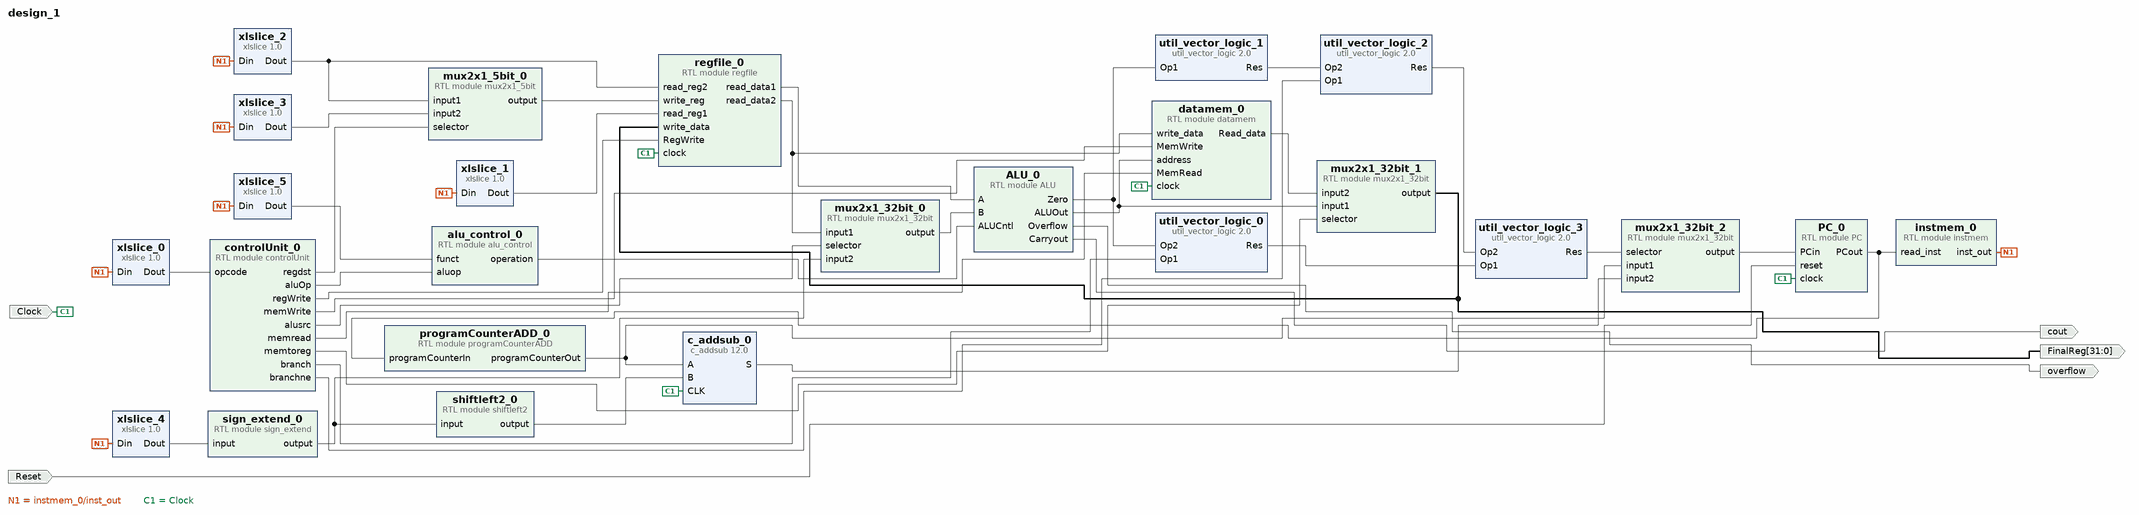
[diagram p0: block diagram of the top level]
# Vivado block design design_1, xc7k70tfbv676-1, Vivado 2019.2.1
create_bd_design design_1

create_bd_port -dir I -type clk Clock
set_property -dict {CONFIG.FREQ_HZ 100000000} [get_bd_ports Clock]
create_bd_port -dir I -type rst Reset
set_property -dict {CONFIG.POLARITY ACTIVE_HIGH} [get_bd_ports Reset]
create_bd_port -dir O -from 31 -to 0 -type data FinalReg
create_bd_port -dir O -type data overflow
create_bd_port -dir O -type data cout

create_bd_cell -type module -reference ALU ALU_0
create_bd_cell -type module -reference PC PC_0
create_bd_cell -type module -reference datamem datamem_0
create_bd_cell -type module -reference instmem instmem_0
create_bd_cell -type module -reference mux2x1_5bit mux2x1_5bit_0
create_bd_cell -type module -reference programCounterADD programCounterADD_0
create_bd_cell -type module -reference regfile regfile_0
create_bd_cell -type module -reference shiftleft2 shiftleft2_0
create_bd_cell -type module -reference sign_extend sign_extend_0
create_bd_cell -type module -reference controlUnit controlUnit_0
create_bd_cell -type ip -vlnv xilinx.com:ip:xlslice:1.0 xlslice_0
set_property -dict {CONFIG.DIN_FROM 31 CONFIG.DIN_TO 26 CONFIG.DIN_WIDTH 32 CONFIG.DOUT_WIDTH 6} [get_bd_cells xlslice_0]
create_bd_cell -type ip -vlnv xilinx.com:ip:xlslice:1.0 xlslice_1
set_property -dict {CONFIG.DIN_FROM 25 CONFIG.DIN_TO 21 CONFIG.DIN_WIDTH 32 CONFIG.DOUT_WIDTH 5} [get_bd_cells xlslice_1]
create_bd_cell -type ip -vlnv xilinx.com:ip:xlslice:1.0 xlslice_2
set_property -dict {CONFIG.DIN_FROM 20 CONFIG.DIN_TO 16 CONFIG.DIN_WIDTH 32 CONFIG.DOUT_WIDTH 5} [get_bd_cells xlslice_2]
create_bd_cell -type ip -vlnv xilinx.com:ip:xlslice:1.0 xlslice_3
set_property -dict {CONFIG.DIN_FROM 15 CONFIG.DIN_TO 11 CONFIG.DIN_WIDTH 32 CONFIG.DOUT_WIDTH 5} [get_bd_cells xlslice_3]
create_bd_cell -type ip -vlnv xilinx.com:ip:xlslice:1.0 xlslice_4
set_property -dict {CONFIG.DIN_FROM 15 CONFIG.DIN_TO 0 CONFIG.DIN_WIDTH 32 CONFIG.DOUT_WIDTH 16} [get_bd_cells xlslice_4]
create_bd_cell -type ip -vlnv xilinx.com:ip:xlslice:1.0 xlslice_5
set_property -dict {CONFIG.DIN_FROM 5 CONFIG.DIN_TO 0 CONFIG.DIN_WIDTH 32 CONFIG.DOUT_WIDTH 6} [get_bd_cells xlslice_5]
create_bd_cell -type ip -vlnv xilinx.com:ip:c_addsub:12.0 c_addsub_0
set_property -dict [list \
  CONFIG.A_Width 32 \
  CONFIG.B_Value 00000000000000000000000000000000 \
  CONFIG.B_Width 32 \
  CONFIG.CE false \
  CONFIG.Latency 1 \
  CONFIG.Out_Width 32 \
] [get_bd_cells c_addsub_0]
create_bd_cell -type ip -vlnv xilinx.com:ip:util_vector_logic:2.0 util_vector_logic_0
set_property -dict {CONFIG.C_SIZE 1} [get_bd_cells util_vector_logic_0]
create_bd_cell -type ip -vlnv xilinx.com:ip:util_vector_logic:2.0 util_vector_logic_1
set_property -dict {CONFIG.C_OPERATION not CONFIG.C_SIZE 1} [get_bd_cells util_vector_logic_1]
create_bd_cell -type ip -vlnv xilinx.com:ip:util_vector_logic:2.0 util_vector_logic_2
set_property -dict {CONFIG.C_SIZE 1} [get_bd_cells util_vector_logic_2]
create_bd_cell -type ip -vlnv xilinx.com:ip:util_vector_logic:2.0 util_vector_logic_3
set_property -dict {CONFIG.C_OPERATION or CONFIG.C_SIZE 1} [get_bd_cells util_vector_logic_3]
create_bd_cell -type module -reference mux2x1_32bit mux2x1_32bit_0
create_bd_cell -type module -reference mux2x1_32bit mux2x1_32bit_1
create_bd_cell -type module -reference mux2x1_32bit mux2x1_32bit_2
create_bd_cell -type module -reference alu_control alu_control_0

# ---- connections ----

connect_bd_net [get_bd_pins PC_0/PCout] [get_bd_pins instmem_0/read_inst] [get_bd_pins programCounterADD_0/programCounterIn]
connect_bd_net [get_bd_pins instmem_0/inst_out] \
  [get_bd_pins xlslice_0/Din] [get_bd_pins xlslice_1/Din] [get_bd_pins xlslice_2/Din] [get_bd_pins xlslice_3/Din] \
  [get_bd_pins xlslice_4/Din] [get_bd_pins xlslice_5/Din]
connect_bd_net [get_bd_pins xlslice_0/Dout] [get_bd_pins controlUnit_0/opcode]
connect_bd_net [get_bd_pins xlslice_1/Dout] [get_bd_pins regfile_0/read_reg1]
connect_bd_net [get_bd_pins xlslice_2/Dout] [get_bd_pins regfile_0/read_reg2] [get_bd_pins mux2x1_5bit_0/input1]
connect_bd_net [get_bd_pins controlUnit_0/regdst] [get_bd_pins mux2x1_5bit_0/selector]
connect_bd_net [get_bd_pins xlslice_3/Dout] [get_bd_pins mux2x1_5bit_0/input2]
connect_bd_net [get_bd_pins mux2x1_5bit_0/output] [get_bd_pins regfile_0/write_reg]
connect_bd_net [get_bd_pins xlslice_4/Dout] [get_bd_pins sign_extend_0/input]
connect_bd_net [get_bd_pins xlslice_5/Dout] [get_bd_pins alu_control_0/funct]
connect_bd_net [get_bd_pins sign_extend_0/output] [get_bd_pins shiftleft2_0/input] [get_bd_pins mux2x1_32bit_0/input2]
connect_bd_net [get_bd_pins controlUnit_0/regWrite] [get_bd_pins regfile_0/RegWrite]
connect_bd_net [get_bd_pins regfile_0/read_data1] [get_bd_pins ALU_0/A]
connect_bd_net [get_bd_pins mux2x1_32bit_0/output] [get_bd_pins ALU_0/B]
connect_bd_net [get_bd_pins regfile_0/read_data2] [get_bd_pins datamem_0/write_data] [get_bd_pins mux2x1_32bit_0/input1]
connect_bd_net [get_bd_pins controlUnit_0/alusrc] [get_bd_pins mux2x1_32bit_0/selector]
connect_bd_net [get_bd_pins controlUnit_0/aluOp] [get_bd_pins alu_control_0/aluop]
connect_bd_net [get_bd_pins alu_control_0/operation] [get_bd_pins ALU_0/ALUCntl]
connect_bd_net [get_bd_pins controlUnit_0/memWrite] [get_bd_pins datamem_0/MemWrite]
connect_bd_net [get_bd_pins controlUnit_0/memread] [get_bd_pins datamem_0/MemRead]
connect_bd_net [get_bd_pins controlUnit_0/memtoreg] [get_bd_pins mux2x1_32bit_1/selector]
connect_bd_net [get_bd_pins datamem_0/Read_data] [get_bd_pins mux2x1_32bit_1/input2]
connect_bd_net [get_bd_pins ALU_0/ALUOut] [get_bd_pins datamem_0/address] [get_bd_pins mux2x1_32bit_1/input1]
connect_bd_net [get_bd_pins mux2x1_32bit_1/output] [get_bd_pins regfile_0/write_data] [get_bd_ports FinalReg]
connect_bd_net [get_bd_pins shiftleft2_0/output] [get_bd_pins c_addsub_0/B]
connect_bd_net [get_bd_pins programCounterADD_0/programCounterOut] [get_bd_pins c_addsub_0/A] [get_bd_pins mux2x1_32bit_2/input1]
connect_bd_net [get_bd_pins c_addsub_0/S] [get_bd_pins mux2x1_32bit_2/input2]
connect_bd_net [get_bd_pins controlUnit_0/branch] [get_bd_pins util_vector_logic_0/Op1]
connect_bd_net [get_bd_pins ALU_0/Zero] [get_bd_pins util_vector_logic_0/Op2] [get_bd_pins util_vector_logic_1/Op1]
connect_bd_net [get_bd_pins util_vector_logic_1/Res] [get_bd_pins util_vector_logic_2/Op2]
connect_bd_net [get_bd_pins controlUnit_0/branchne] [get_bd_pins util_vector_logic_2/Op1]
connect_bd_net [get_bd_pins util_vector_logic_2/Res] [get_bd_pins util_vector_logic_3/Op2]
connect_bd_net [get_bd_pins util_vector_logic_0/Res] [get_bd_pins util_vector_logic_3/Op1]
connect_bd_net [get_bd_pins util_vector_logic_3/Res] [get_bd_pins mux2x1_32bit_2/selector]
connect_bd_net [get_bd_pins mux2x1_32bit_2/output] [get_bd_pins PC_0/PCin]
connect_bd_net [get_bd_ports Clock] [get_bd_pins PC_0/clock] [get_bd_pins regfile_0/clock] [get_bd_pins datamem_0/clock] [get_bd_pins c_addsub_0/CLK]
connect_bd_net [get_bd_ports Reset] [get_bd_pins PC_0/reset]
connect_bd_net [get_bd_pins ALU_0/Overflow] [get_bd_ports overflow]
connect_bd_net [get_bd_pins ALU_0/Carryout] [get_bd_ports cout]

validate_bd_design
save_bd_design
